# Altium schematic sheet MCISO-S05-V00-CANIsolation.SchDoc: Isolated Canbus
size A3; DrawnBy: John Hatfield; SheetNumber: 4; SheetTotal: 8
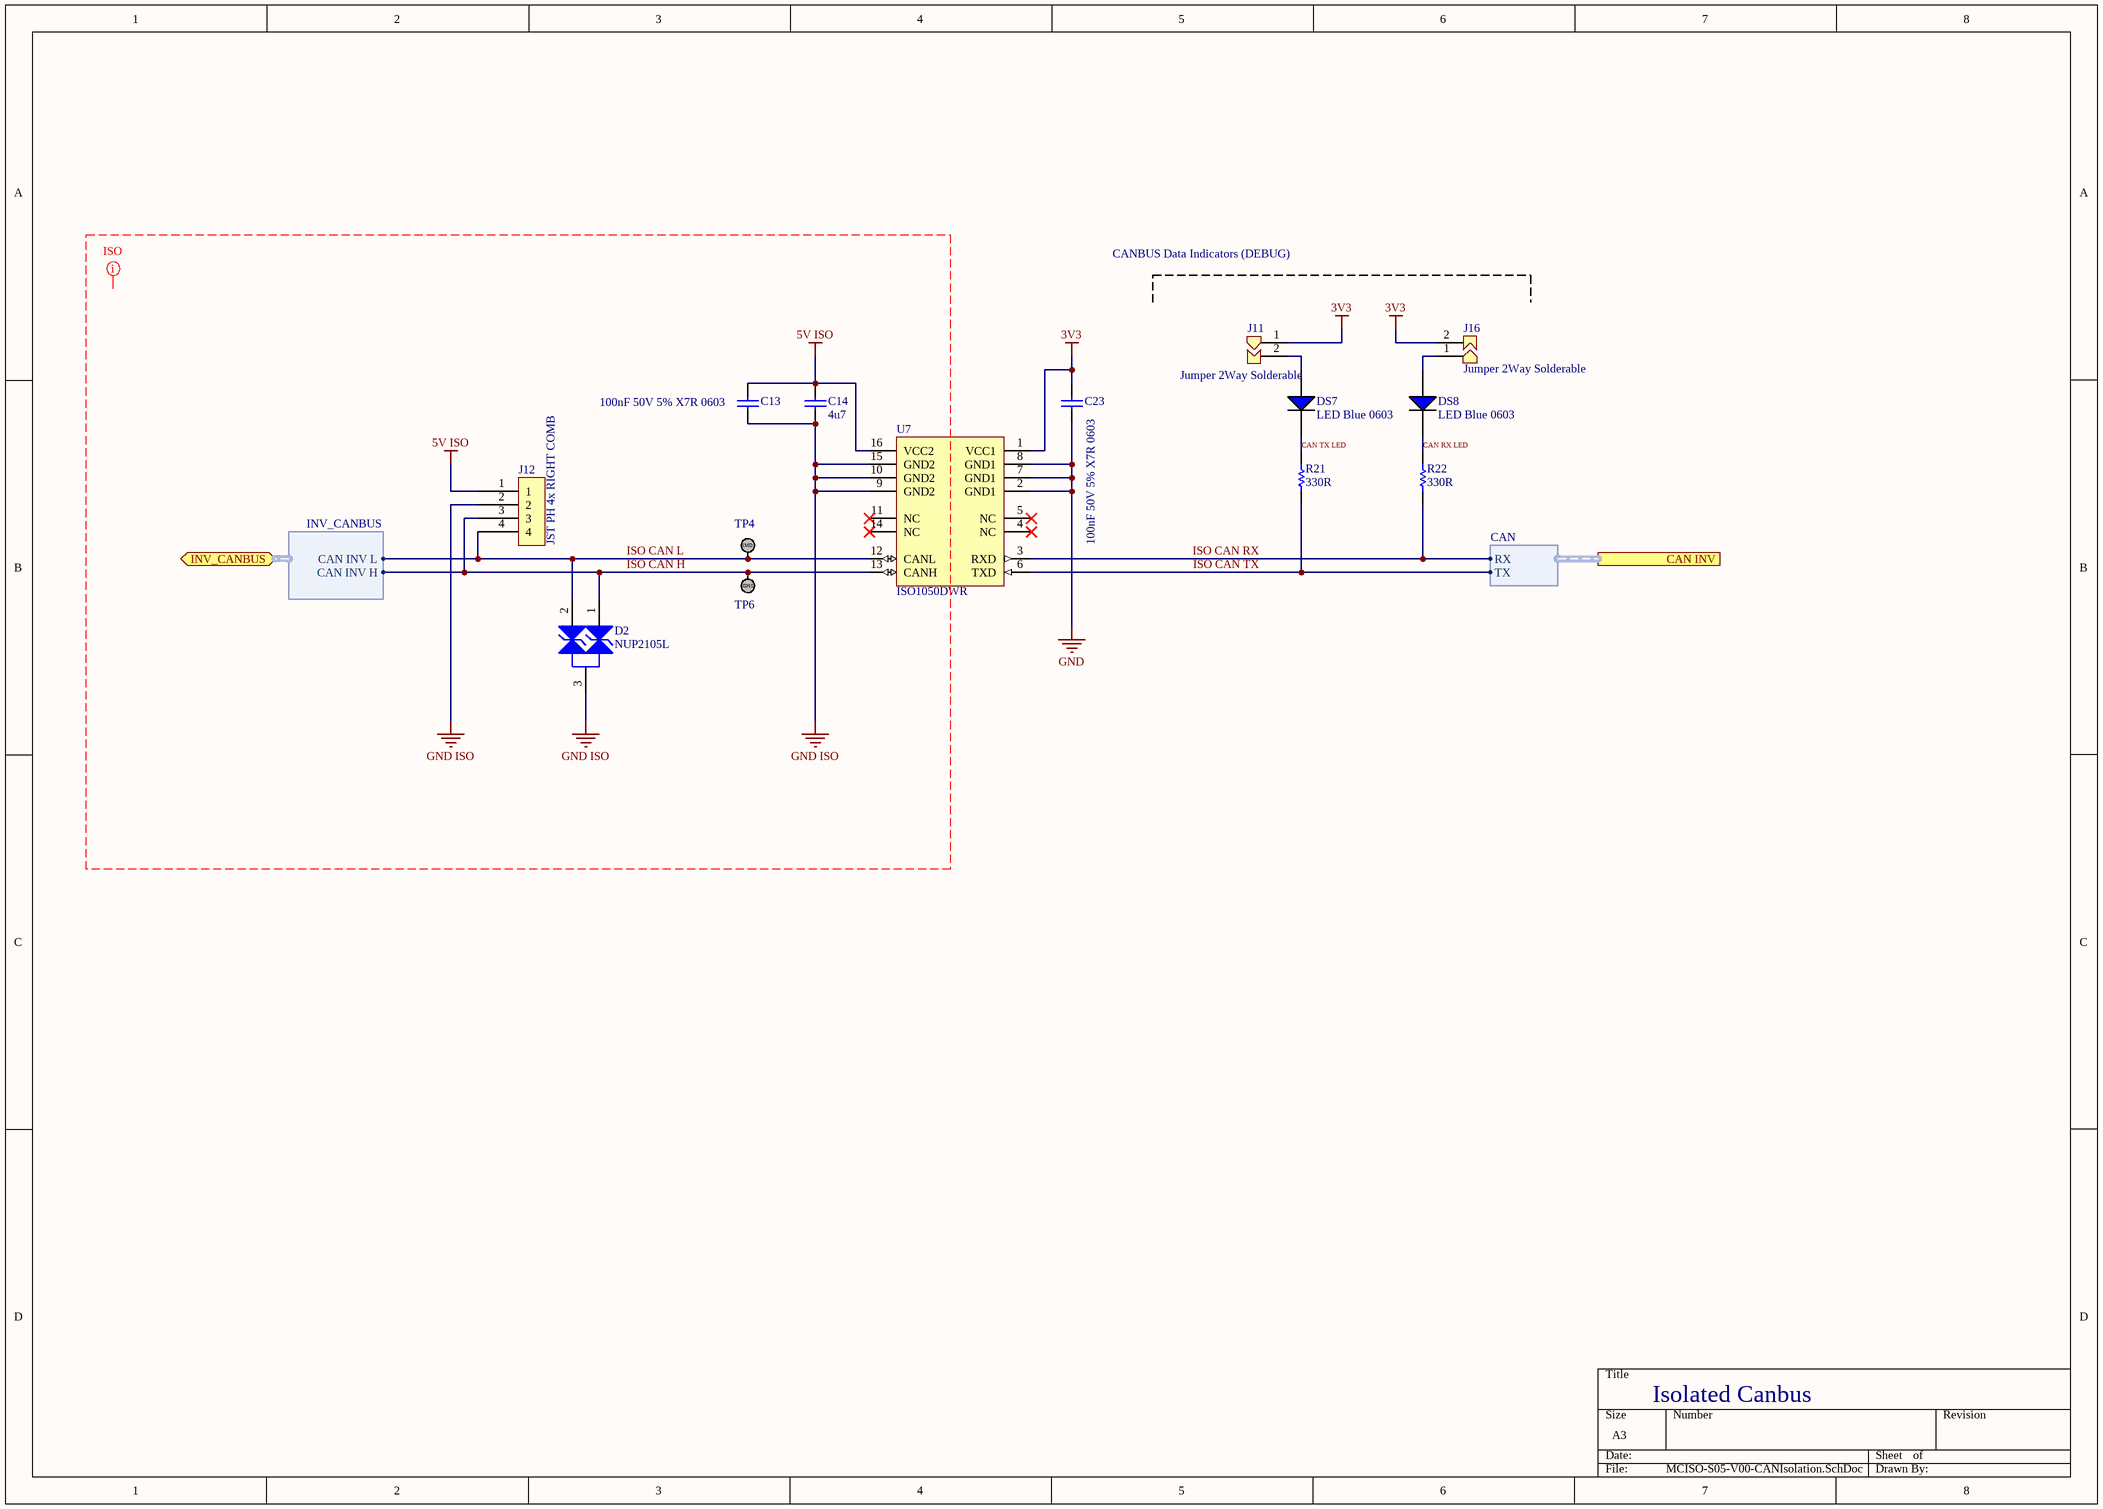
[diagram p0: MCISO-S05-V00-CANIsolation.SchDoc]

## Parts
C13  100nF 50V 5% X7R 0603  [Cap_Ceramic_0603]
C14  4u7  [Cap_Ceramic_0603]
C23  100nF 50V 5% X7R 0603  [Cap_Ceramic_0603]
D2  NUP2105L  [NUP2105L]
DS7  LED Blue 0603  [LED BLUE 0603]
DS8  LED Blue 0603  [LED BLUE 0603]
J11  Jumper 2Way Solderable  [Jumper_2Way_Solderable]
J12  JST PH 4x RIGHT COMB  [JST PH 4x RIGHT COMB]
J16  Jumper 2Way Solderable  [Jumper_2Way_Solderable]
R21  330R  [Res_ThinFilm_0603]
R22  330R  [Res_ThinFilm_0603]
TP4  TestPoint_SMD  [TestPointSMD]  (value not drawn)
TP6  TestPoint_SMD  [TestPointSMD]  (value not drawn)
U7  ISO1050DWR  [DW00016B_V]

## Ports
CAN INV (harness CAN), INV_CANBUS (bidir, harness INV_CANBUS)

## Harnesses
INV_CANBUS: CAN INV L, CAN INV H
CAN: TX, RX

## Nets
3V3: C23.2 J11.1 J16.2 U7.1(VCC1)
5V ISO: C13.2 C14.2 J12.1 U7.16(VCC2)
GND: C23.1 U7.2(GND1) U7.7(GND1) U7.8(GND1)
GND ISO: C13.1 C14.1 D2.3 J12.2 U7.9(GND2) U7.10(GND2) U7.15(GND2)
CAN RX LED: DS8.2(C) R22.2
CAN TX LED: DS7.2(C) R21.2
ISO CAN H: D2.1 J12.3 TP6.1 U7.13(CANH) ; port INV_CANBUS.CAN INV H
ISO CAN L: D2.2 J12.4 TP4.1 U7.12(CANL) ; port INV_CANBUS.CAN INV L
ISO CAN RX: R22.1 U7.3(RXD) ; port CAN INV.RX
ISO CAN TX: R21.1 U7.6(TXD) ; port CAN INV.TX
NetDS7_1: DS7.1(A) J11.2
NetDS8_1: DS8.1(A) J16.1

Not connected (* = marked no-connect by the designer): U7 4(NC)* 5(NC)* 11(NC)* 14(NC)*

## Layout directives
mark named ISO: 5V ISO, GND ISO, ISO CAN H, ISO CAN L

## Notes on the sheet
- CANBUS Data Indicators (DEBUG)
- Isolated Canbus
- (in symbol TestPoint_SMD) SMD

## Library data of the parts
C13 C23 = 100nF 50V 5% X7R 0603: Capacitor, Ceramic, SMD, 100nF, 50V, 5%, X7R, 0603
C14 = 4u7 50V 5% X7R 0603: Capacitor, Ceramic, SMD, 4u7, 50V, 5%, X7R, 0603
J11 J16 = Jumper 2Way Side Solderable
J12 = JST PH 4x RIGHT COMB: CAN Ethernet Bridge Port
R21 R22 = 330R 5% 0603: Resistor, SMD, 330R, 0.1W, 5%, 0603
U7 = ISO1050DWR: Isolated CAN Transceiver, -55 to 105 degC, 16-pin SOIC (DW), Green (RoHS & no Sb/Br); Manufacturer: Texas Instruments; Isolated: Yes; Rating: Catalog; Drivers Per Package: 1; ComponentLink1Description: Datasheet; SubFamily: CAN; Mounting Technology: Surface Mount; PackageReference: DW00016B; Code_JEDEC: MS-013-AA; PackageVersion: revG, Jan-2011; ComponentLink2URL: http://www.ti.com/litv/pdf/msoi003g; PartNumber: ISO1050DWR; DatasheetVersion: SLLS983E; Eco-Plan: Green (RoHS & no Sb/Br); ComponentLink1URL: http://www.ti.com/general/docs/lit/getliterature.tsp?genericPartNumber=ISO1050&fileType=pdf; ComponentLink2Description: Package Specification; PackageDescription: 16-Pin Small Outline Integrated Circuit, 10.3 x 7.5 mm, Pitch 1.27 mm Pitch
D2 = NUP2105L: ComponentLink1Description: Datasheet; ComponentLink1URL: https://www.onsemi.cn/PowerSolutions/document/NUP2105L-D.PDF; Parameter 1: *; ComponentLink2Description: LCSC; ComponentLink2URL: https://lcsc.com/product-detail/TVS_ON-Semiconductor-NUP2105LT1G_C14486.html; ComponentLink3Description: Digikey; ComponentLink3URL: https://www.digikey.com.au/product-detail/en/on-semiconductor/SZNUP2105LT1G/SZNUP2105LT1GOSCT-ND/3487669